# EAGLE board Precision Arduino 7400 (EAGLE 6.2), part 1 of 2
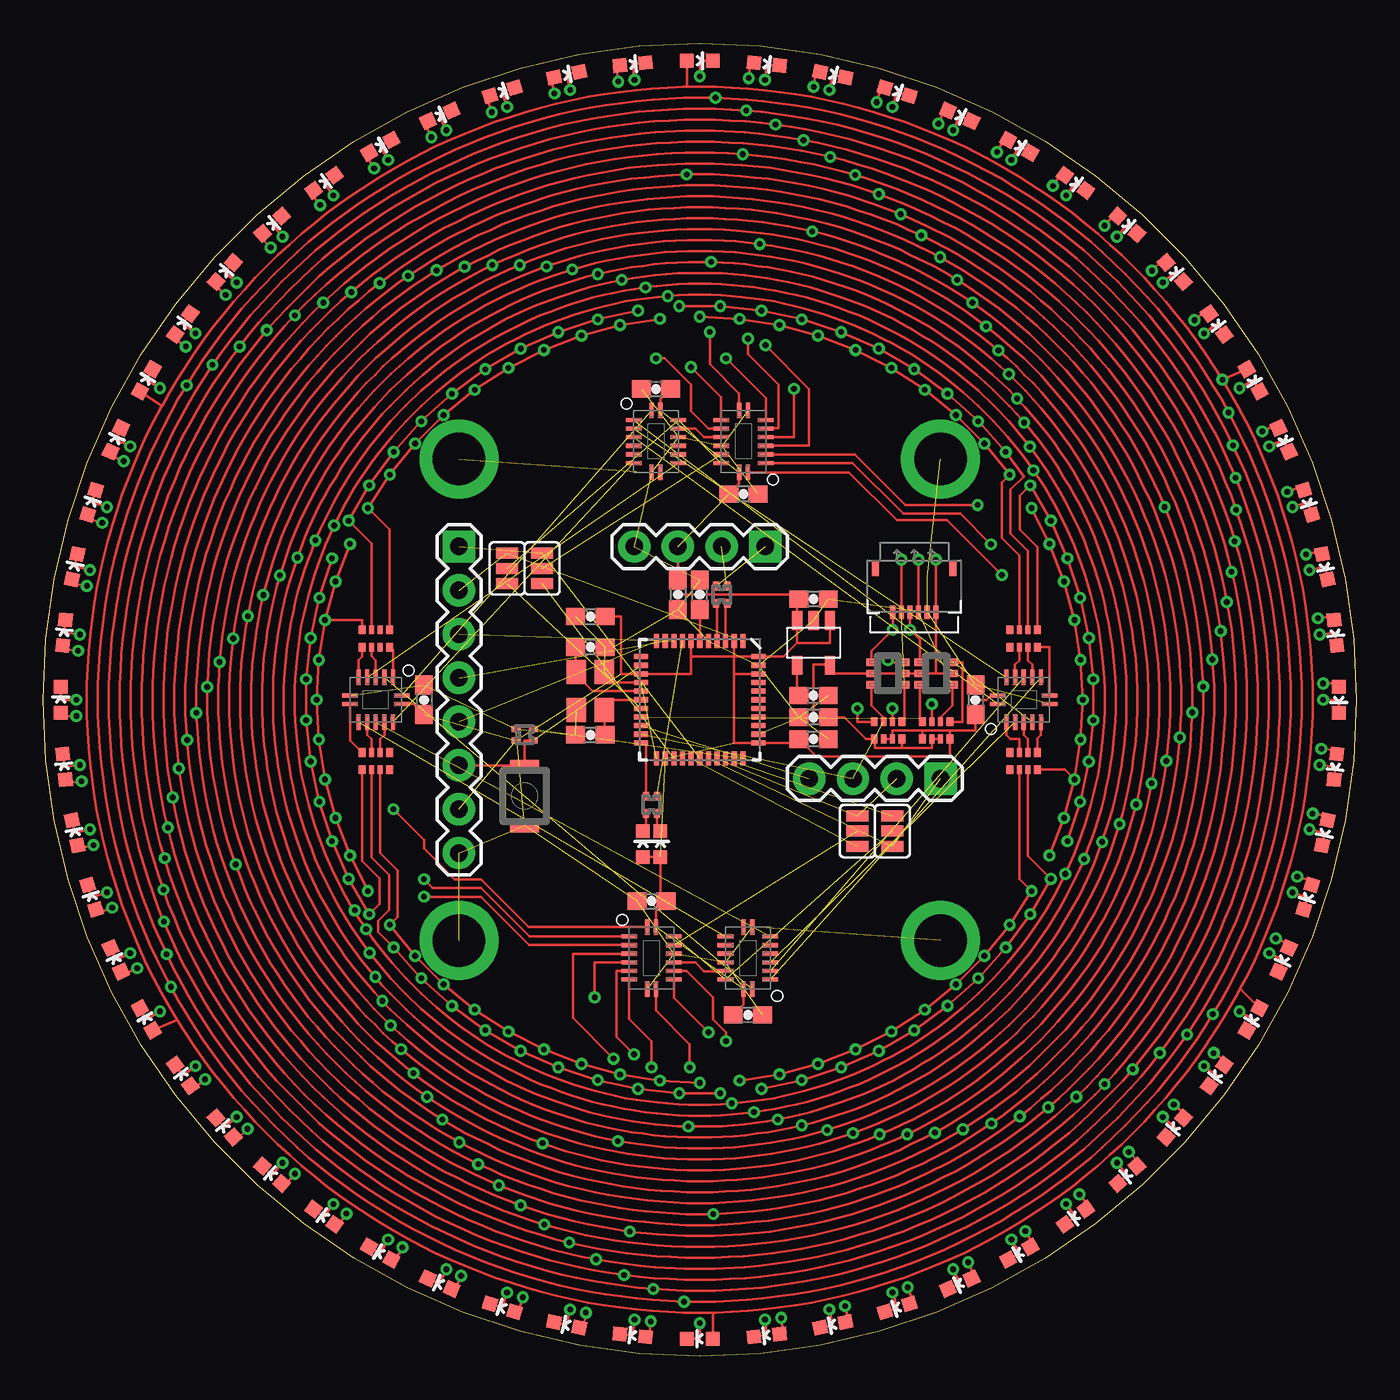
[diagram p1: board, top side]
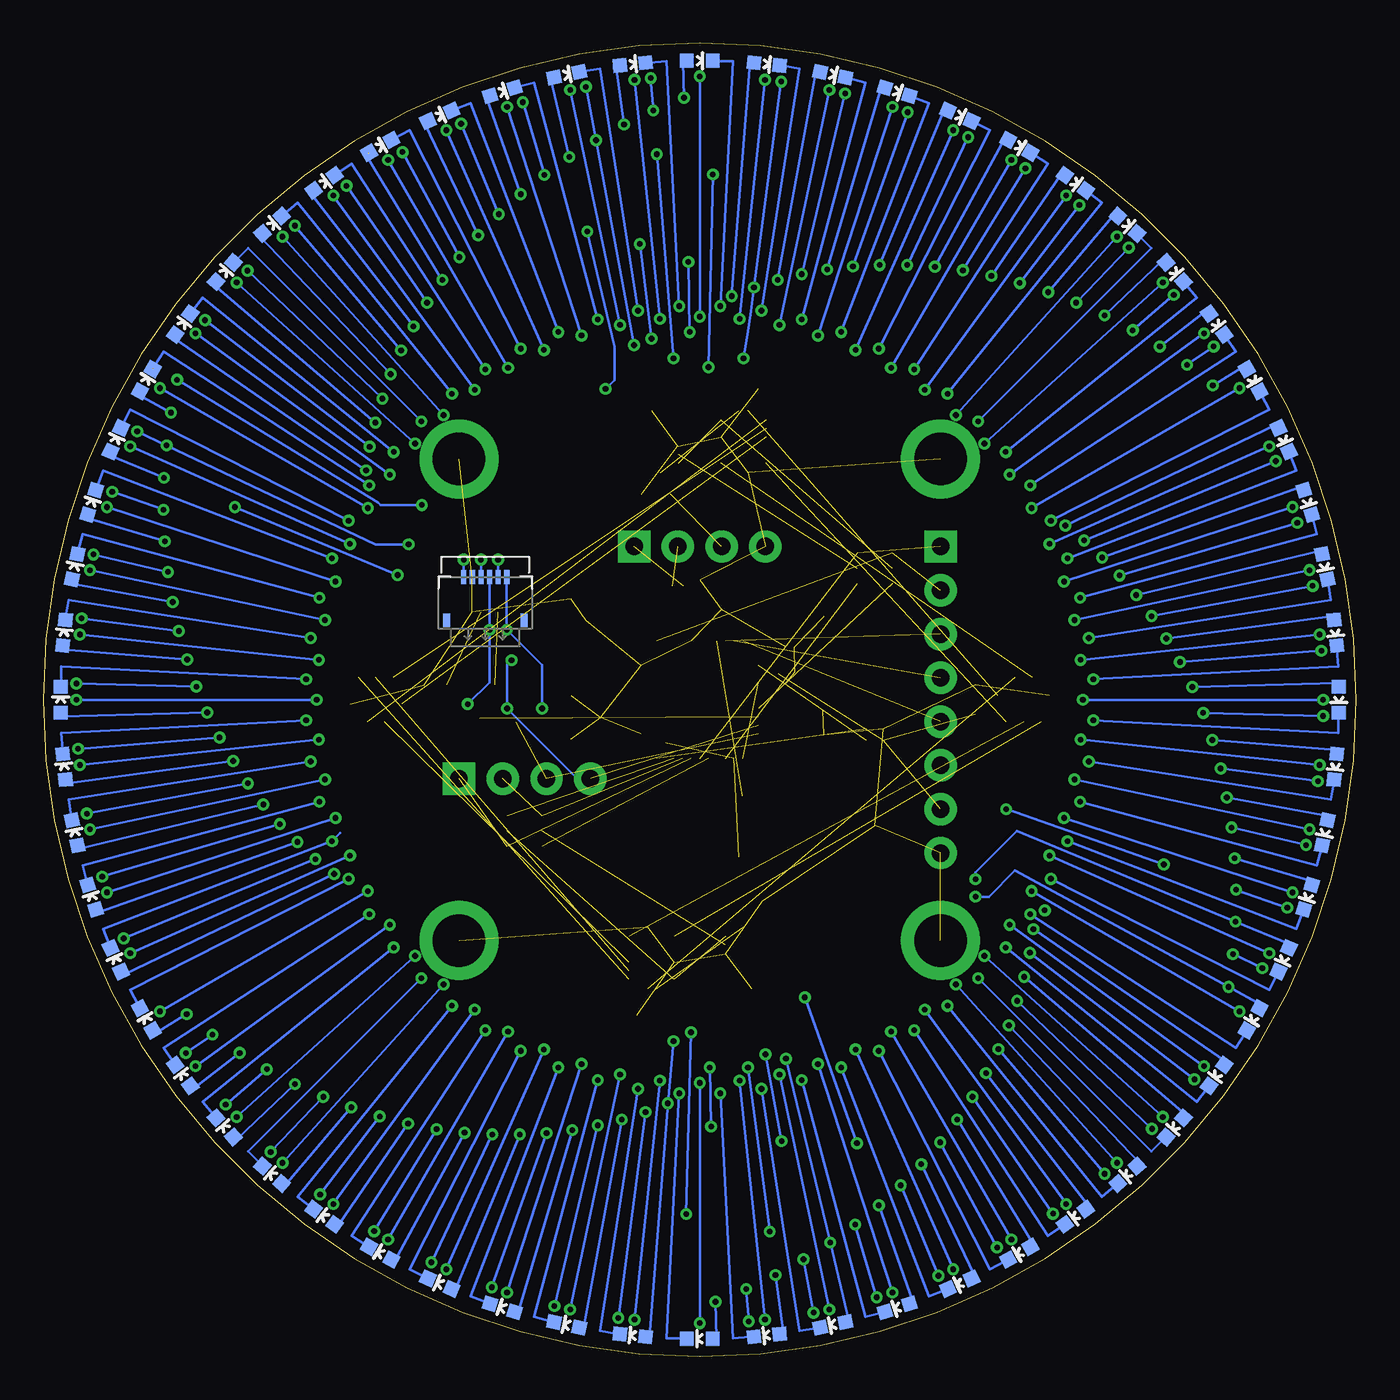
[diagram p2: board, bottom side, seen from below]

Size 76.2 x 76.2 mm. Coordinates in mm from the lower left corner, seen from the top.
Outline: 0,38.1 arc-90 38.1,76.2 arc-90 76.2,38.1 arc-90 38.1,0 arc-90 0,38.1
Copper layers (1*16): Top 0.0356mm / dielectric 1.5011mm / Bottom 0.0356mm
Design rules: minimum track width 6mil, minimum drill 13mil, track to track 6mil, track to pad 6mil, pad to pad 6mil, via to via 6mil, smd to smd 6mil, copper to edge 15mil, drill to drill 6mil, minimum pad ring 7mil, minimum via ring 7mil, stop-mask expansion 4mil, vias tented up to drill 0mil, thermal gap 10mil
Net classes: 0 default: width 0.152 mm, drill 0.33 mm, clearance 0.152 mm; 1 power: width 0.152 mm, drill 0.33 mm, clearance 0.152 mm

## Footprints (pad centres in the part's own frame; a part is rotated, then mirrored left to right if it is on the bottom)
0603-CAP = smd 1.1 x 1: 1 -0.85,0; 2 0.85,0
LED-0603 = smd 0.8 x 0.8: A 0,-0.75; C 0,0.75
STANDOFF = drill 3.048 pad 4.572: P$1 0,0
1X04 = drill 1.016 pad 1.88 square: 1 0,0 | drill 1.016 pad 1.88: 2 2.54,0; 3 5.08,0; 4 7.62,0
1X08 = drill 1.016 pad 1.88 square: 1 0,0 | drill 1.016 pad 1.88: 2 2.54,0; 3 5.08,0; 4 7.62,0; 5 10.16,0; 6 12.7,0; 7 15.24,0; 8 17.78,0
SOT-363 = smd 0.42 x 0.6: 1 -0.65,-0.95; 2 0,-0.95; 3 0.65,-0.95; 4 0.65,0.95; 5 0,0.95; 6 -0.65,0.95
CRA02 = smd 0.35 x 0.5: 1 -0.325,-0.5; 2 0.325,-0.5; 3 0.325,0.5; 4 -0.325,0.5
CRA04 = smd 0.4 x 0.5: 1 -0.8,-0.5; 4 0.8,-0.5; 5 0.8,0.5; 8 -0.8,0.5 | smd 0.3 x 0.5: 2 -0.25,-0.5; 3 0.25,-0.5; 6 0.25,0.5; 7 -0.25,0.5
SJ_3 = smd 0.635 x 1.27: 1 -0.889,0; 3 0.889,0; COM 0,0
B3U-1000P = smd 0.8 x 1.7: P$1 -1.7,0; P$2 1.7,0
DHVQFN16 = smd 0.9 x 0.24: 1 -1.8,-0.25; 8 1.8,-0.25; 9 1.8,0.25; 16 -1.8,0.25 | smd 0.24 x 0.9: 2 -1.25,-1.3; 3 -0.75,-1.3; 4 -0.25,-1.3; 5 0.25,-1.3; 6 0.75,-1.3; 7 1.25,-1.3; 10 1.25,1.3; 11 0.75,1.3; 12 0.25,1.3; 13 -0.25,1.3; 14 -0.75,1.3; 15 -1.25,1.3
DHVQFN14 = smd 0.9 x 0.24: 1 -1.5,-0.25; 7 1.5,-0.25; 8 1.5,0.25; 14 -1.5,0.25 | smd 0.24 x 0.9: 2 -1,-1.3; 3 -0.5,-1.3; 4 0,-1.3; 5 0.5,-1.3; 6 1,-1.3; 9 1,1.3; 10 0.5,1.3; 11 0,1.3; 12 -0.5,1.3; 13 -1,1.3
GP-2106 = smd 0.3 x 0.8: 1PPS -0.25,0; GND -0.75,0; ONOFF 0.25,0; RX 0.75,0; TX 1.25,0; VCC -1.25,0 | smd 0.4 x 0.8: P$7 -2.25,-2.5; P$8 2.25,-2.5
SOT-23-5 = smd 0.6 x 1.1: 1 -0.95,-1.3; 2 0,-1.3; 3 0.95,-1.3; 4 0.95,1.3; 5 -0.95,1.3
SPARKFUN-DIGITALIC_QFN-44-NOPAD = smd 0.8 x 0.3: 1 -3.4,2.5; 2 -3.4,2; 3 -3.4,1.5; 4 -3.4,1; 5 -3.4,0.5; 6 -3.4,0; 7 -3.4,-0.5; 8 -3.4,-1; 9 -3.4,-1.5; 10 -3.4,-2; 11 -3.4,-2.5; 23 3.4,-2.5; 24 3.4,-2; 25 3.4,-1.5; 26 3.4,-1; 27 3.4,-0.5; 28 3.4,0; 29 3.4,0.5; 30 3.4,1; 31 3.4,1.5; 32 3.4,2; 33 3.4,2.5 | smd 0.3 x 0.8: 12 -2.5,-3.4; 13 -2,-3.4; 14 -1.5,-3.4; 15 -1,-3.4; 16 -0.5,-3.4; 17 0,-3.4; 18 0.5,-3.4; 19 1,-3.4; 20 1.5,-3.4; 21 2,-3.4; 22 2.5,-3.4; 34 2.5,3.4; 35 2,3.4; 36 1.5,3.4; 37 1,3.4; 38 0.5,3.4; 39 0,3.4; 40 -0.5,3.4; 41 -1,3.4; 42 -1.5,3.4; 43 -2,3.4; 44 -2.5,3.4
CRYSTAL_SMD = smd 1.4 x 1.15: 1 -1.092,-0.813; 2 1.092,-0.813; 3 1.092,0.813; 4 -1.092,0.813

## Placement (x,y rotation side)
C001  100nF  [0603-CAP]  40.64,50.04 180 top
C002  100nF  [0603-CAP]  54.1,38.1 270 top
C004  4.7uF  [0603-CAP]  36.83,44.2 270 top
C010  100nF  [0603-CAP]  35.56,56.13 0 top
C035  100nF  [0603-CAP]  22.1,38.1 270 top
C101  100nF  [0603-CAP]  35.31,26.42 0 top
C110  100nF  [0603-CAP]  40.89,19.81 180 top
C201  4.7uF  [0603-CAP]  44.7,37.08 180 top
C203  100nF  [0603-CAP]  44.7,38.35 0 top
C204  1uF  [0603-CAP]  44.7,43.94 0 top
C406  1uF  [0603-CAP]  38.1,44.2 90 top
C414  100nF  [0603-CAP]  31.75,42.93 0 top
C416  18pF  [0603-CAP]  31.75,41.15 180 top
C417  18pF  [0603-CAP]  31.75,36.07 0 top
C434  100nF  [0603-CAP]  44.7,35.81 180 top
D000  RED  [LED-0603]  38.1,75.18 270 top
D001  RED  [LED-0603]  41.99,74.98 264 top
D002  RED  [LED-0603]  45.82,74.37 258 top
D003  RED  [LED-0603]  49.56,73.38 252 top
D004  RED  [LED-0603]  53.19,71.98 246 top
D005  RED  [LED-0603]  56.64,70.21 240 top
D006  RED  [LED-0603]  59.89,68.1 234 top
D007  RED  [LED-0603]  62.92,65.66 228 top
D008  RED  [LED-0603]  65.66,62.92 222 top
D009  RED  [LED-0603]  68.1,59.89 216 top
D010  RED  [LED-0603]  70.21,56.64 210 top
D011  RED  [LED-0603]  71.98,53.19 204 top
D012  RED  [LED-0603]  73.38,49.56 198 top
D013  RED  [LED-0603]  74.37,45.82 192 top
D014  RED  [LED-0603]  74.98,41.99 186 top
D015  RED  [LED-0603]  75.18,38.1 180 top
D016  RED  [LED-0603]  74.98,34.21 174 top
D017  RED  [LED-0603]  74.37,30.38 168 top
D018  RED  [LED-0603]  73.38,26.64 162 top
D019  RED  [LED-0603]  71.98,23.01 156 top
D020  RED  [LED-0603]  70.21,19.56 150 top
D021  RED  [LED-0603]  68.1,16.31 144 top
D022  RED  [LED-0603]  65.66,13.28 138 top
D023  RED  [LED-0603]  62.92,10.54 132 top
D024  RED  [LED-0603]  59.89,8.1 126 top
D025  RED  [LED-0603]  56.64,5.99 120 top
D026  RED  [LED-0603]  53.19,4.22 114 top
D027  RED  [LED-0603]  49.56,2.82 108 top
D028  RED  [LED-0603]  45.82,1.83 102 top
D029  RED  [LED-0603]  41.99,1.22 96 top
D030  RED  [LED-0603]  38.1,1.02 90 top
D031  RED  [LED-0603]  34.21,1.22 84 top
D032  RED  [LED-0603]  30.38,1.83 78 top
D033  RED  [LED-0603]  26.64,2.82 72 top
D034  RED  [LED-0603]  23.01,4.22 66 top
D035  RED  [LED-0603]  19.56,5.99 60 top
D036  RED  [LED-0603]  16.31,8.1 54 top
D037  RED  [LED-0603]  13.28,10.54 48 top
D038  RED  [LED-0603]  10.54,13.28 42 top
D039  RED  [LED-0603]  8.1,16.31 36 top
D040  RED  [LED-0603]  5.99,19.56 30 top
D041  RED  [LED-0603]  4.22,23.01 24 top
D042  RED  [LED-0603]  2.82,26.64 18 top
D043  RED  [LED-0603]  1.83,30.38 12 top
D044  RED  [LED-0603]  1.22,34.21 6 top
D045  RED  [LED-0603]  1.02,38.1 0 top
D046  RED  [LED-0603]  1.22,41.99 354 top
D047  RED  [LED-0603]  1.83,45.82 348 top
D048  RED  [LED-0603]  2.82,49.56 342 top
D049  RED  [LED-0603]  4.22,53.19 336 top
D050  RED  [LED-0603]  5.99,56.64 330 top
D051  RED  [LED-0603]  8.1,59.89 324 top
D052  RED  [LED-0603]  10.54,62.92 318 top
D053  RED  [LED-0603]  13.28,65.66 312 top
D054  RED  [LED-0603]  16.31,68.1 306 top
D055  RED  [LED-0603]  19.56,70.21 300 top
D056  RED  [LED-0603]  23.01,71.98 294 top
D057  RED  [LED-0603]  26.64,73.38 288 top
D058  RED  [LED-0603]  30.38,74.37 282 top
D059  RED  [LED-0603]  34.21,74.98 276 top
D100  RED  [LED-0603]  38.1,75.18 270 bottom
D101  RED  [LED-0603]  41.99,74.98 276 bottom
D102  RED  [LED-0603]  45.82,74.37 282 bottom
D103  RED  [LED-0603]  49.56,73.38 288 bottom
D104  RED  [LED-0603]  53.19,71.98 294 bottom
D105  RED  [LED-0603]  56.64,70.21 300 bottom
D106  RED  [LED-0603]  59.89,68.1 306 bottom
D107  RED  [LED-0603]  62.92,65.66 312 bottom
D108  RED  [LED-0603]  65.66,62.92 318 bottom
D109  RED  [LED-0603]  68.1,59.89 324 bottom
D110  RED  [LED-0603]  70.21,56.64 330 bottom
D111  RED  [LED-0603]  71.98,53.19 336 bottom
D112  RED  [LED-0603]  73.38,49.56 342 bottom
D113  RED  [LED-0603]  74.37,45.82 348 bottom
D114  RED  [LED-0603]  74.98,41.99 354 bottom
D115  RED  [LED-0603]  75.18,38.1 0 bottom
D116  RED  [LED-0603]  74.98,34.21 6 bottom
D117  RED  [LED-0603]  74.37,30.38 12 bottom
D118  RED  [LED-0603]  73.38,26.64 18 bottom
D119  RED  [LED-0603]  71.98,23.01 24 bottom
D120  RED  [LED-0603]  70.21,19.56 30 bottom
D121  RED  [LED-0603]  68.1,16.31 36 bottom
D122  RED  [LED-0603]  65.66,13.28 42 bottom
D123  RED  [LED-0603]  62.92,10.54 48 bottom
D124  RED  [LED-0603]  59.89,8.1 54 bottom
D125  RED  [LED-0603]  56.64,5.99 60 bottom
D126  RED  [LED-0603]  53.19,4.22 66 bottom
D127  RED  [LED-0603]  49.56,2.82 72 bottom
D128  RED  [LED-0603]  45.82,1.83 78 bottom
D129  RED  [LED-0603]  41.99,1.22 84 bottom
D130  RED  [LED-0603]  38.1,1.02 90 bottom
D131  RED  [LED-0603]  34.21,1.22 96 bottom
D132  RED  [LED-0603]  30.38,1.83 102 bottom
D133  RED  [LED-0603]  26.64,2.82 108 bottom
D134  RED  [LED-0603]  23.01,4.22 114 bottom
D135  RED  [LED-0603]  19.56,5.99 120 bottom
D136  RED  [LED-0603]  16.31,8.1 126 bottom
D137  RED  [LED-0603]  13.28,10.54 132 bottom
D138  RED  [LED-0603]  10.54,13.28 138 bottom
D139  RED  [LED-0603]  8.1,16.31 144 bottom
D140  RED  [LED-0603]  5.99,19.56 150 bottom
D141  RED  [LED-0603]  4.22,23.01 156 bottom
D142  RED  [LED-0603]  2.82,26.64 162 bottom
D143  RED  [LED-0603]  1.83,30.38 168 bottom
D144  RED  [LED-0603]  1.22,34.21 174 bottom
D145  RED  [LED-0603]  1.02,38.1 180 bottom
D146  RED  [LED-0603]  1.22,41.99 186 bottom
D147  RED  [LED-0603]  1.83,45.82 192 bottom
D148  RED  [LED-0603]  2.82,49.56 198 bottom
D149  RED  [LED-0603]  4.22,53.19 204 bottom
D150  RED  [LED-0603]  5.99,56.64 210 bottom
D151  RED  [LED-0603]  8.1,59.89 216 bottom
D152  RED  [LED-0603]  10.54,62.92 222 bottom
D153  RED  [LED-0603]  13.28,65.66 228 bottom
D154  RED  [LED-0603]  16.31,68.1 234 bottom
D155  RED  [LED-0603]  19.56,70.21 240 bottom
D156  RED  [LED-0603]  23.01,71.98 246 bottom
D157  RED  [LED-0603]  26.64,73.38 252 bottom
D158  RED  [LED-0603]  30.38,74.37 258 bottom
D159  RED  [LED-0603]  34.21,74.98 264 bottom
D408  RED  [LED-0603]  35.81,29.72 0 top
D422  BLUE  [LED-0603]  34.8,29.72 0 top
JP1  STANDOFF  [STANDOFF]  52.07,52.07 0 top
JP2  STANDOFF  [STANDOFF]  52.07,24.13 0 top
JP3  STANDOFF  [STANDOFF]  24.13,52.07 0 top
JP4  STANDOFF  [STANDOFF]  24.13,24.13 0 top
JP5  [1X04]  52.07,33.53 180 top
JPRG  [1X08]  24.13,46.99 270 top
JUSB1  [1X04]  41.91,46.99 180 top
Q301  BSS138DW  [SOT-363]  49.02,39.62 270 top
Q302  BSS138DW  [SOT-363]  51.82,39.62 90 top
R5  22  [CRA02]  39.37,44.2 180 top
R020  91  [CRA04]  56.9,34.54 180 top
R021  91  [CRA04]  56.9,41.66 0 top
R301  10k  [CRA04]  51.82,36.32 180 top
R302  10k  [CRA04]  49.02,36.32 180 top
R350  91  [CRA04]  19.3,34.54 180 top
R351  91  [CRA04]  19.3,41.66 0 top
R413  10k  [CRA02]  27.94,36.07 270 top
R501  680  [CRA02]  35.31,32 180 top
S0C  SOLDERJUMPER_3WAY  [SJ_3]  28.96,45.72 270 top
S0R  SOLDERJUMPER_3WAY  [SJ_3]  26.92,45.72 270 top
S1C  SOLDERJUMPER_3WAY  [SJ_3]  47.24,30.48 90 top
S1R  SOLDERJUMPER_3WAY  [SJ_3]  49.28,30.48 90 top
S429  B3U-1000P  [B3U-1000P]  27.94,32.51 90 top
U001  74HC4017  [DHVQFN16]  40.64,53.09 90 top
U002  74LVC14A  [DHVQFN14]  56.9,38.1 0 top
U003  GP-2106  [GP-2106]  50.55,43.18 180 top
U004  GP-2106  [GP-2106]  50.55,45.21 0 bottom
U010  74HC4017  [DHVQFN16]  35.56,53.09 270 top
U035  74LVC14A  [DHVQFN14]  19.3,38.1 180 top
U101  74HC4017  [DHVQFN16]  35.31,23.11 270 top
U110  74HC4017  [DHVQFN16]  40.89,23.11 90 top
U201  1.8V  [SOT-23-5]  44.7,41.4 180 top
U401  ATMEGA32U4QFN2  [SPARKFUN-DIGITALIC_QFN-44-NOPAD]  38.1,38.1 270 top
Y401  16MHz  [CRYSTAL_SMD]  31.75,38.61 90 top

## Tracks (layer width: path | path; a pad name or v marks a point on that pad's centre or on a via)
1.8V  (via drill 0.33)
  Top 0.152: 51.8,39.62 Q302.5 Q301.5 Q301.2 45.65,39.62 U201.5 45.65,40.13 44.7,40.13 44.7,37.08 C201.1 46.48,37.08 47.74,35.82 R302.5 48.26,35.78 48.26,35.31 49.82,35.31 | 51.8,39.62 Q302.2 | 51.8,39.62 U003.VCC 51.8,45.72 v51.8,46.23 | 49.78,35.82 R302.8 49.82,35.31 | R301.7 R301.6 51.57,35.31 49.82,35.31
  Bottom 0.152: U004.VCC v51.8,46.23
C0  (1 unrouted)
C1  (1 unrouted)
C2  (2 unrouted)
C3  (2 unrouted)
CARRY0
  Top 0.152: U010.14 37.86,53.84 38.36,53.34 U001.12
CARRY1
  Top 0.152: U101.12 37.84,22.86 38.35,22.35 U110.14
CLK0  (1 unrouted)
CLK1  (1 unrouted)
D+  (1 unrouted)
D-  (1 unrouted)
GND  (41 unrouted)
  Top 0.152: 33.1,39.09 U401.15 | C416.1 33.1,41.15 | 39.32,52.83 U001.13 39.4,52.83 | 36.88,53.34 U010.13
HWB  (1 unrouted)
MISO  (1 unrouted)
MOSI  (1 unrouted)
N$17
  Top 0.152: U201.4 43.75,38.35 C203.1
ONOFF
  Top 0.152: Q302.3 53.34,40.27 53.34,36.82 R301.1
ONOFF_LO  (via drill 0.33)
  Top 0.152: U003.ONOFF v50.3,42.16 50.87,41.59 Q302.4 | R301.3 v51.57,37.84 arc90 v51.56,37.85
  Bottom 0.152: U004.ONOFF v50.3,42.16 50.3,39.11 v51.56,37.85
P00X  (1 unrouted)
P0X0  (via drill 0.33)  (1 unrouted)
  Top 0.152: 37.34,73.66 37.16,73.66 36.25,73.61 35.31,73.56 34.39,73.46 33.45,73.36 32.54,73.23 31.62,73.08 29.79,72.67 28.91,72.44 27.99,72.19 27.1,71.91 26.24,71.63 25.35,71.3 24.49,70.94 23.65,70.59 22.78,70.21 21.95,69.77 21.13,69.34 20.32,68.89 19.53,68.43 17.96,67.41 17.2,66.88 16.46,66.32 15.72,65.73 15.01,65.15 14.3,64.52 13.61,63.91 12.29,62.59 11.68,61.9 11.05,61.19 10.46,60.48 9.88,59.74 9.32,59 8.79,58.24 7.77,56.67 7.32,55.88 6.9,55.14 | 37.34,73.66 39.04,73.66 39.95,73.61 40.89,73.56 41.81,73.46 42.75,73.36 43.66,73.23 44.58,73.08 46.41,72.67 47.3,72.44 48.21,72.19 49.1,71.91 49.96,71.63 50.85,71.3 51.71,70.94 52.55,70.59 53.42,70.21 54.25,69.77 55.07,69.34 55.88,68.89 56.67,68.43 58.24,67.41 59,66.88 59.74,66.32 60.48,65.73 61.19,65.15 61.9,64.52 62.59,63.91 63.91,62.59 64.52,61.9 65.15,61.19 65.73,60.48 66.32,59.74 66.88,59 67.41,58.24 68.06,57.24 68.26,56.93 v68.43,56.67 | v68.43,56.67 68.89,55.88 69.34,55.07 69.77,54.25 70.21,53.42 70.59,52.55 70.94,51.71 71.3,50.85 71.63,49.96 71.91,49.1 72.19,48.21 72.44,47.3 72.67,46.41 73.08,44.58 73.23,43.66 73.36,42.75 73.46,41.81 73.56,40.89 73.61,39.95 73.66,39.04 73.66,37.16 73.61,36.25 73.56,35.31 73.46,34.39 73.36,33.45 73.23,32.54 73.08,31.62 72.67,29.79 72.44,28.91 72.19,27.99 71.91,27.1 71.63,26.24 71.3,25.35 70.94,24.49 70.59,23.65 70.21,22.78 69.77,21.95 69.44,21.32 | 69.44,21.32 69.34,21.13 68.89,20.32 68.43,19.53 67.41,17.96 66.88,17.2 66.32,16.46 65.73,15.72 65.15,15.01 64.52,14.3 63.91,13.61 62.59,12.29 61.9,11.68 61.19,11.05 60.48,10.46 59.74,9.88 59,9.32 58.24,8.79 56.67,7.77 55.88,7.32 55.07,6.86 54.25,6.43 53.42,5.99 52.55,5.61 51.71,5.26 50.85,4.9 49.96,4.57 49.1,4.29 48.21,4.01 47.3,3.76 46.41,3.53 44.58,3.12 43.66,2.97 42.75,2.85 41.81,2.74 40.89,2.64 39.95,2.59 39.04,2.54 38.86,2.54
  Top 0.152: 38.86,2.54 37.16,2.54 36.25,2.59 35.31,2.64 34.39,2.74 33.45,2.85 32.54,2.97 31.62,3.12 29.79,3.53 28.91,3.76 27.99,4.01 27.1,4.29 26.24,4.57 25.35,4.9 24.49,5.26 23.65,5.61 22.78,5.99 21.95,6.43 21.13,6.86 20.32,7.32 19.53,7.77 17.96,8.79 17.2,9.32 16.46,9.88 15.72,10.46 15.01,11.05 14.3,11.68 13.61,12.29 12.29,13.61 11.68,14.3 11.05,15.01 10.46,15.72 9.88,16.46 9.32,17.2 8.79,17.96 8.14,18.96 7.77,19.53 | 7.77,19.53 7.32,20.32 6.86,21.13 6.43,21.95 5.99,22.78 5.61,23.65 5.26,24.49 4.9,25.35 4.57,26.24 4.29,27.1 4.01,27.99 3.76,28.91 3.53,29.79 3.12,31.62 2.97,32.54 2.85,33.45 2.74,34.39 2.64,35.31 2.59,36.25 2.54,37.16 2.54,39.04 2.59,39.95 2.64,40.89 2.74,41.81 2.85,42.75 2.97,43.66 3.12,44.58 3.53,46.41 3.76,47.3 4.01,48.21 4.29,49.1 4.57,49.96 4.9,50.85 5.26,51.71 5.61,52.55 5.99,53.42 6.43,54.25 6.86,55.07 6.9,55.14 | D000.A 37.35,73.67 37.34,73.66 | 38.86,2.54 38.86,1.02 D030.A | 6.38,18.92 D040.A 7.77,19.53 | 70.56,20.22 69.49,21.29 69.44,21.32 | 70.56,20.22 D020.A | D020.A | D050.A 5.64,55.98 6.9,55.14 | 69.83,57.28 D010.A v68.43,56.67 | U001.3 47.1,52.34 50.04,49.4 v54.23,49.4 | D020.A 70.56,20.22
  Bottom 0.152: v68.43,56.67 56.76,49.55 | 56.76,49.54 56.76,49.55 | v54.23,49.4 56.62,49.4 56.76,49.55
P0X1  (via drill 0.33)
  Top 0.152: v40.95,74.17 41.02,75.06 41.22,75.06 D001.A | 71.58,54.08 71.55,54.06 | 71.55,54.06 v70.74,53.67 | v67.92,17.6 68.66,17.09 68.66,17.02 68.56,16.92 D021.A | v35.26,2.03 35.18,1.14 34.98,1.14 D031.A | 4.62,22.12 4.65,22.14 | 4.65,22.14 v5.46,22.53 | v8.28,58.6 7.54,59.11 7.54,59.18 7.64,59.28 D051.A | D041.A 4.55,22.33 4.62,22.25 4.62,22.2 4.65,22.14 | D011.A 71.65,53.87 71.58,53.95 71.58,54 71.55,54.06 | U001.2 46.97,51.84 49.91,48.9 53.21,48.9 v54.99,47.12 | 36.3,72.34 37.21,72.39 38.99,72.39 39.9,72.34 v40.79,72.29 41.68,72.21 43.46,71.96 44.35,71.81 45.24,71.63 46.1,71.45 46.97,71.22 48.69,70.71 49.55,70.43 51.23,69.77 52.05,69.42 53.67,68.66 55.24,67.79 56.01,67.33 57.53,66.37 58.27,65.84 58.98,65.3 59.69,64.75 60.38,64.19 62.36,62.36 64.19,60.38 64.75,59.69 65.3,58.98 65.84,58.27 66.37,57.53 67.33,56.01 67.79,55.24 68.66,53.67 v69.04,52.86 69.42,52.05 69.77,51.23 70.43,49.55 70.71,48.69 71.22,46.97 71.45,46.1 71.63,45.24 71.81,44.35 71.96,43.46 72.21,41.68 72.29,40.79 72.34,39.9 72.39,38.99 72.39,37.21 72.34,36.3 72.29,35.41 72.21,34.52 71.96,32.74 71.81,31.85 71.63,30.96 71.45,30.1 71.22,29.23 70.71,27.51 70.43,26.64 69.77,24.97 69.42,24.16 68.66,22.53 67.79,20.95 67.33,20.19 v66.37,18.67 65.84,17.93 65.3,17.22 64.75,16.51 64.19,15.82 62.36,13.84 60.38,12.01 59.69,11.46 58.98,10.9 58.27,10.36 57.53,9.83 56.01,8.87 55.24,8.41 53.67,7.54 52.05,6.78 51.23,6.43 49.55,5.77 48.69,5.49 46.97,4.98 46.1,4.75 45.24,4.57 44.35,4.39 43.46,4.24 41.68,3.99 40.79,3.91 39.9,3.86 38.99,3.81 37.21,3.81 36.3,3.86 v35.41,3.91 34.52,3.99 32.74,4.24 31.85,4.39 30.96,4.57 30.1,4.75 29.23,4.98 27.51,5.49 26.64,5.77 24.97,6.43 24.16,6.78 22.53,7.54 20.95,8.41 20.19,8.87 18.67,9.83 17.93,10.36 17.22,10.9 16.51,11.46 15.82,12.01 13.84,13.84 12.01,15.82 11.46,16.51 10.9,17.22 10.36,17.93 9.83,18.67 8.87,20.19 8.41,20.95 7.54,22.53 v7.16,23.34 6.78,24.16 6.43,24.97 5.77,26.64 5.49,27.51 4.98,29.23 4.75,30.1 4.57,30.96 4.39,31.85 4.24,32.74 3.99,34.52 3.91,35.41 3.86,36.3 3.81,37.21 3.81,38.99 3.86,39.9 3.91,40.79 3.99,41.68 4.24,43.46 4.39,44.35 4.57,45.24 4.75,46.1 4.98,46.97 5.49,48.69 5.77,49.55 6.43,51.23 6.78,52.05 7.54,53.67 8.41,55.24 8.87,56.01 v9.83,57.53 10.36,58.27 10.9,58.98 11.46,59.69 12.01,60.38 13.84,62.36 15.82,64.19 16.51,64.75 17.22,65.3 17.93,65.84 18.67,66.37 20.19,67.33 20.95,67.79 22.53,68.66 24.16,69.42 24.97,69.77 26.64,70.43 27.51,70.71 29.23,71.22 30.1,71.45 30.96,71.63 31.85,71.81 32.74,71.96 34.52,72.21 35.41,72.29 36.3,72.34
  Bottom 0.152: v40.79,72.29 v40.95,74.17 | v70.74,53.67 v69.04,52.86 56.9,47.09 55.02,47.09 v54.99,47.12 | v66.37,18.67 v67.92,17.6 | v35.41,3.91 v35.26,2.03 | v7.16,23.34 v5.46,22.53 | v9.83,57.53 v8.28,58.6
P0X2  (via drill 0.33)
  Top 0.152: 44.86,74.57 44.85,74.53 | 44.85,74.53 v44.7,73.66 | 73.05,50.47 73.03,50.46 | 73.03,50.46 v72.19,50.16 | v65.61,14.61 66.29,14.02 66.27,13.95 D022.A | 31.34,1.63 31.35,1.67 | 31.35,1.67 v31.5,2.54 | 3.15,25.73 3.17,25.74 | 3.17,25.74 v4.01,26.04 | v10.59,61.59 9.91,62.18 9.93,62.26 D052.A | D042.A 3.07,25.91 3.15,25.83 3.15,25.81 3.17,25.74 | 73.03,50.46 73.05,50.39 73.13,50.32 73.13,50.29 D012.A | D032.A 31.29,1.68 31.35,1.67 | D002.A 44.91,74.52 44.85,74.53 | U001.4 44.45,52.84 44.45,56.13 v41.91,58.67 | 37.24,71.12 38.96,71.12 40.69,71.02 41.55,70.94 42.42,70.84 43.26,70.71 v44.12,70.56 44.96,70.41 46.63,70 48.31,69.49 49.94,68.94 50.72,68.61 51.54,68.28 52.32,67.89 53.09,67.51 54.61,66.7 56.08,65.79 57.51,64.82 58.88,63.75 59.54,63.22 60.2,62.64 60.83,62.05 62.05,60.83 62.64,60.2 63.22,59.54 63.75,58.88 64.82,57.51 65.79,56.08 66.7,54.61 67.51,53.09 67.89,52.32 68.28,51.54 68.61,50.72 68.94,49.94 v69.22,49.12 69.49,48.31 70,46.63 70.41,44.96 70.56,44.12 70.71,43.26 70.84,42.42 70.94,41.55 71.02,40.69 71.12,38.96 71.12,37.24 71.02,35.51 70.94,34.65 70.84,33.78 70.71,32.94 70.56,32.08 70.41,31.24 70,29.57 69.49,27.89 68.94,26.26 68.61,25.48 68.28,24.66 67.89,23.88 67.51,23.11 66.7,21.59 65.79,20.12 64.82,18.69 63.75,17.32 v63.22,16.66 62.64,16 62.05,15.37 60.83,14.15 60.2,13.56 59.54,12.98 58.88,12.45 57.51,11.38 56.08,10.41 54.61,9.5 53.09,8.69 52.32,8.31 51.54,7.92 50.72,7.59 49.94,7.26 48.31,6.71 46.63,6.2 44.96,5.79 44.12,5.64 43.26,5.49 42.42,5.36 41.55,5.26 40.69,5.18 38.96,5.08 37.24,5.08 35.51,5.18 34.65,5.26 33.78,5.36 32.94,5.49 v32.08,5.64 31.24,5.79 29.57,6.2 27.89,6.71 26.26,7.26 25.48,7.59 24.66,7.92 23.88,8.31 23.11,8.69 21.59,9.5 20.12,10.41 18.69,11.38 17.32,12.45 16.66,12.98 16,13.56 15.37,14.15 14.15,15.37 13.56,16 12.98,16.66 12.45,17.32 11.38,18.69 10.41,20.12 9.5,21.59 8.69,23.11 8.31,23.88 7.92,24.66 7.59,25.48 7.26,26.26 v6.99,27.08 6.71,27.89 6.2,29.57 5.79,31.24 5.64,32.08 5.49,32.94 5.36,33.78 5.26,34.65 5.18,35.51 5.08,37.24 5.08,38.96 5.18,40.69 5.26,41.55 5.36,42.42 5.49,43.26 5.64,44.12 5.79,44.96 6.2,46.63 6.71,48.31 7.26,49.94 7.59,50.72 7.92,51.54 8.31,52.32 8.69,53.09 9.5,54.61 10.41,56.08 11.38,57.51 12.45,58.88 v12.98,59.54 13.56,60.2 14.15,60.83 15.37,62.05 16,62.64 16.66,63.22 17.32,63.75 18.69,64.82 20.12,65.79 21.59,66.7 23.11,67.51 23.88,67.89 24.66,68.28 25.48,68.61 26.26,68.94 27.89,69.49 29.57,70 31.24,70.41 32.08,70.56 32.94,70.71 33.78,70.84 34.65,70.94 35.51,71.02 37.24,71.12
  Bottom 0.152: v44.7,73.66 v44.12,70.56 v41.91,58.67 | v69.22,49.12 v72.19,50.16 | v63.22,16.66 v65.61,14.61 | v32.08,5.64 v31.5,2.54 | v6.99,27.08 v4.01,26.04 | v12.98,59.54 v10.59,61.59
P0X3  (via drill 0.33)
  Top 0.152: v48.36,72.77 48.64,73.66 48.82,73.66 48.82,73.64 D003.A | 74.17,46.76 74.15,46.76 | 74.15,46.76 v73.28,46.53 | v62.99,11.86 63.63,11.2 D023.A | 27.56,2.54 27.57,2.57 | 27.57,2.57 v27.84,3.43 | 2.03,29.44 2.05,29.44 | 2.05,29.44 v2.92,29.67 | v13.21,64.34 12.57,65 D053.A | D033.A 27.38,2.59 27.51,2.59 27.57,2.57 | D043.A 2.01,29.64 2.03,29.62 2.03,29.52 2.05,29.44 | D013.A 74.19,46.56 74.17,46.58 74.17,46.69 74.15,46.76 | v39.62,57.91 41.94,55.6 U001.7 | 36.45,69.8 37.26,69.85 38.94,69.85 39.75,69.8 v40.59,69.75 41.43,69.67 42.24,69.57 43.08,69.47 43.96,69.3 44.7,69.16 46.33,68.76 v47.12,68.56 47.9,68.3 49.48,67.74 50.24,67.44 51,67.11 51.77,66.75 52.5,66.4 53.24,66.02 53.98,65.61 54.69,65.18 55.4,64.72 56.08,64.26 56.77,63.78 57.43,63.3 58.09,62.76 58.73,62.26 59.94,61.14 60.55,60.55 61.14,59.94 62.26,58.73 62.76,58.09 63.3,57.43 63.78,56.77 64.26,56.08 64.72,55.4 65.18,54.69 65.61,53.98 66.02,53.24 66.4,52.5 66.75,51.77 67.11,51 67.44,50.24 67.74,49.48 68.3,47.9 68.56,47.12 68.76,46.33 v68.96,45.52 69.16,44.7 69.47,43.08 69.57,42.24 69.67,41.43 69.75,40.59 69.8,39.75 69.85,38.94 69.85,37.26 69.8,36.45 69.75,35.61 69.67,34.77 69.57,33.96 69.47,33.12 69.16,31.5 68.76,29.87 68.56,29.08 68.3,28.3 67.74,26.72 67.44,25.96 67.11,25.2 66.75,24.43 66.4,23.7 66.02,22.96 65.61,22.23 65.18,21.51 64.72,20.8 64.26,20.12 63.78,19.43 63.3,18.77 62.76,18.11 62.26,17.48 61.14,16.26 60.55,15.65 v59.94,15.06 58.73,13.95 58.09,13.44 57.43,12.9 56.77,12.42 56.08,11.94 55.4,11.48 54.69,11.02 53.98,10.59 53.24,10.19 52.5,9.8 51.77,9.45 51,9.09 50.24,8.76 49.48,8.46 47.9,7.9 47.12,7.64 46.33,7.44 44.7,7.04 43.08,6.73 42.24,6.63 41.43,6.53 40.59,6.45 39.75,6.4 38.94,6.35 37.26,6.35 36.45,6.4 35.61,6.45 34.77,6.53 33.96,6.63 33.12,6.73 31.5,7.04 29.87,7.44 v29.08,7.64 28.3,7.9 26.72,8.46 25.96,8.76 25.2,9.09 24.43,9.45 23.7,9.8 22.96,10.19 22.23,10.59 21.51,11.02 20.8,11.48 20.12,11.94 19.43,12.42 18.77,12.9 18.11,13.44 17.48,13.95 16.26,15.06 15.65,15.65 15.06,16.26 13.95,17.48 13.44,18.11 12.9,18.77 12.42,19.43 11.94,20.12 11.48,20.8 11.02,21.51 10.59,22.23 10.19,22.96 9.8,23.7 9.45,24.43 9.09,25.2 8.76,25.96 8.46,26.72 7.9,28.3 7.64,29.08 7.44,29.87 v7.24,30.68 7.04,31.5 6.73,33.12 6.63,33.96 6.53,34.77 6.45,35.61 6.4,36.45 6.35,37.26 6.35,38.94 6.4,39.75 6.45,40.59 6.53,41.43 6.63,42.24 6.73,43.08 7.04,44.7 7.44,46.33 7.64,47.12 7.9,47.9 8.46,49.48 8.76,50.24 9.09,51 9.45,51.77 9.8,52.5 10.19,53.24 10.59,53.98 11.02,54.69 11.48,55.4 11.94,56.08 12.42,56.77 12.9,57.43 13.44,58.09 13.95,58.73 15.06,59.94 15.65,60.55 v16.26,61.14 17.48,62.26 18.11,62.76 18.77,63.3 19.43,63.78 20.12,64.26 20.8,64.72 21.51,65.18 22.23,65.61 22.96,66.02 23.7,66.4 24.43,66.75 25.2,67.11 25.96,67.44 26.72,67.74 28.3,68.3 29.08,68.56 29.87,68.76 31.5,69.16 33.12,69.47 33.96,69.57 34.77,69.67 35.61,69.75 36.45,69.8
  Bottom 0.152: v47.12,68.56 v48.36,72.77 | v68.96,45.52 v73.28,46.53 | v59.94,15.06 v62.99,11.86 | v29.08,7.64 v27.84,3.43 | v7.24,30.68 v2.92,29.67 | v16.26,61.14 v13.21,64.34 | v40.59,69.75 v39.62,57.91
P0X4  (via drill 0.33)
  Top 0.152: 52.3,72.36 52.29,72.34 | 52.29,72.34 v51.94,71.53 | 74.88,42.95 74.87,42.95 | 74.87,42.95 v73.97,42.82 | 60.68,8.69 60.66,8.71 | 60.66,8.71 v60.12,9.4 | 23.9,3.83 23.91,3.86 | 23.91,3.86 v24.26,4.67 | 1.32,33.25 1.33,33.25 | 1.33,33.25 v2.23,33.38 | 15.52,67.51 15.54,67.49 | 15.54,67.49 v16.08,66.8 | D034.A 23.7,3.89 23.85,3.89 23.91,3.86 | 1.33,33.25 1.32,33.33 1.32,33.45 D044.A | D024.A 60.5,8.56 60.6,8.66 60.66,8.71 | D054.A 15.7,67.64 15.6,67.54 15.54,67.49 | D014.A 74.88,42.75 74.88,42.88 74.87,42.95 | D004.A 52.5,72.31 52.35,72.31 52.29,72.34 | v37.59,57.4 39.34,55.66 U001.10 | 36.5,68.53 37.31,68.58 v37.34,68.58 38.89,68.58 39.7,68.53 40.49,68.48 41.27,68.4 42.09,68.33 43.66,68.07 44.42,67.92 45.21,67.74 46,67.54 46.76,67.33 48.28,66.83 v49.76,66.27 51.23,65.61 52.65,64.9 54.03,64.08 54.71,63.65 55.37,63.22 56.01,62.76 56.67,62.28 57.28,61.8 57.89,61.27 58.5,60.76 59.08,60.2 59.66,59.66 60.2,59.08 60.76,58.5 61.27,57.89 61.8,57.28 62.28,56.67 62.76,56.01 63.22,55.37 63.65,54.71 64.08,54.03 64.9,52.65 65.61,51.23 66.27,49.76 66.83,48.28 67.33,46.76 67.54,46 67.74,45.21 67.92,44.42 68.07,43.66 v68.33,42.09 68.4,41.27 68.48,40.49 68.53,39.7 68.58,38.89 68.58,37.31 68.53,36.5 68.48,35.71 68.4,34.92 68.33,34.11 68.07,32.54 67.92,31.77 67.74,30.99 67.54,30.2 67.33,29.44 66.83,27.91 66.27,26.44 65.61,24.97 64.9,23.55 64.08,22.17 63.65,21.49 63.22,20.83 62.76,20.19 62.28,19.53 61.8,18.92 61.27,18.31 60.76,17.7 60.2,17.12 59.66,16.54 59.08,16 58.5,15.44 57.89,14.94 57.28,14.4 v56.67,13.92 56.01,13.44 55.37,12.98 54.71,12.55 54.03,12.12 52.65,11.3 51.23,10.59 49.76,9.93 48.28,9.37 46.76,8.87 46,8.66 45.21,8.46 44.42,8.28 43.66,8.13 42.09,7.87 41.27,7.8 40.49,7.72 39.7,7.67 38.89,7.62 37.31,7.62 36.5,7.67 35.71,7.72 34.92,7.8 34.11,7.87 32.54,8.13 31.77,8.28 30.99,8.46 30.2,8.66 29.44,8.87 27.91,9.37 v26.44,9.93 24.97,10.59 23.55,11.3 22.17,12.12 21.49,12.55 20.83,12.98 20.19,13.44 19.53,13.92 18.92,14.4 18.31,14.94 17.7,15.44 17.12,16 16.54,16.54 16,17.12 15.44,17.7 14.94,18.31 14.4,18.92 13.92,19.53 13.44,20.19 12.98,20.83 12.55,21.49 12.12,22.17 11.3,23.55 10.59,24.97 9.93,26.44 9.37,27.91 8.87,29.44 8.66,30.2 8.46,30.99 8.28,31.77 8.13,32.54 v7.87,34.11 7.8,34.92 7.72,35.71 7.67,36.5 7.62,37.31 7.62,38.89 7.67,39.7 7.72,40.49 7.8,41.27 7.87,42.09 8.13,43.66 8.28,44.42 8.46,45.21 8.66,46 8.87,46.76 9.37,48.28 9.93,49.76 10.59,51.23 11.3,52.65 12.12,54.03 12.55,54.71 12.98,55.37 13.44,56.01 13.92,56.67 14.4,57.28 14.94,57.89 15.44,58.5 16,59.08 16.54,59.66 17.12,60.2 17.7,60.76 18.31,61.27 18.92,61.8 v19.53,62.28 20.19,62.76 20.83,63.22 21.49,63.65 22.17,64.08 23.55,64.9 24.97,65.61 26.44,66.27 27.91,66.83 29.44,67.33 30.2,67.54 30.99,67.74 31.77,67.92 32.54,68.07 34.11,68.33 34.92,68.4 35.71,68.48 36.5,68.53
  Bottom 0.152: v49.76,66.27 v51.94,71.53 | v68.33,42.09 v73.97,42.82 | v56.67,13.92 v60.12,9.4 | v26.44,9.93 v24.26,4.67 | v7.87,34.11 v2.23,33.38 | v19.53,62.28 v16.08,66.8 | v37.34,68.58 v37.59,57.4
P0X5  (via drill 0.33)  (1 unrouted)
  Top 0.152: v55.35,69.88 55.8,70.69 55.88,70.69 D005.A | 75.16,39.06 | 75.16,39.06 v74.27,39.04 | 57.48,6.48 57.46,6.51 | 57.46,6.51 v57,7.26 | v20.85,6.33 20.4,5.51 20.32,5.51 D035.A | 1.04,37.13 | 1.04,37.13 v1.93,37.16 | 18.72,69.72 18.74,69.69 | 18.74,69.69 v19.2,68.94 | D045.A 1.02,37.24 1.04,37.21 1.04,37.13 | D025.A 57.3,6.38 57.4,6.48 57.46,6.51 | 18.9,69.83 18.8,69.72 18.74,69.69 | 18.9,69.83 D055.A | D055.A | D015.A 75.18,38.86 75.16,38.89 75.16,38.99 75.16,39.06 | v55.63,45.34 52.45,48.51 49.53,48.51 46.76,51.29 U001.1 | D055.A 18.92,69.83 18.9,69.83 | 37.34,67.31 38.86,67.31 41.15,67.16 42.67,66.95 43.43,66.83 44.17,66.67 44.91,66.5 45.67,66.32 46.41,66.12 47.12,65.89 47.85,65.63 48.56,65.38 49.28,65.08 49.99,64.8 51.36,64.14 v52.05,63.78 53.37,63.02 54,62.59 54.63,62.18 55.27,61.72 56.49,60.81 57.07,60.3 57.66,59.82 58.22,59.28 59.28,58.22 59.82,57.66 60.3,57.07 60.81,56.49 61.72,55.27 62.18,54.63 62.59,54 63.02,53.37 63.78,52.05 64.14,51.36 64.8,49.99 v65.08,49.28 65.38,48.56 65.63,47.85 65.89,47.12 66.12,46.41 66.32,45.67 66.5,44.91 66.67,44.17 66.83,43.43 66.95,42.67 67.16,41.15 v67.31,38.86 67.31,37.34 67.16,35.05 66.95,33.53 66.83,32.77 66.67,32.03 66.5,31.29 66.32,30.53 66.12,29.79 65.89,29.08 65.63,28.35 65.38,27.64 65.08,26.92 64.8,26.21 64.14,24.84 63.78,24.16 63.02,22.84 62.59,22.2 62.18,21.57 61.72,20.93 60.81,19.71 60.3,19.13 59.82,18.54 59.28,17.98 58.22,16.92 57.66,16.38 57.07,15.9 56.49,15.39 55.27,14.48 54.63,14.02 54,13.61 v53.37,13.18 52.05,12.42 51.36,12.06 49.99,11.4 49.28,11.12 48.56,10.82 47.85,10.57 47.12,10.31 46.41,10.08 45.67,9.88 44.91,9.7 44.17,9.53 43.43,9.37 42.67,9.25 41.15,9.04 38.86,8.89 37.34,8.89 35.05,9.04 33.53,9.25 32.77,9.37 32.03,9.53 31.29,9.7 30.53,9.88 29.79,10.08 29.08,10.31 28.35,10.57 27.64,10.82 26.92,11.12 26.21,11.4 24.84,12.06 v24.16,12.42 22.84,13.18 22.2,13.61 21.57,14.02 20.93,14.48 19.71,15.39 19.13,15.9 18.54,16.38 17.98,16.92 16.92,17.98 16.38,18.54 15.9,19.13 15.39,19.71 14.48,20.93 14.02,21.57 13.61,22.2 13.18,22.84 12.42,24.16 12.06,24.84 11.4,26.21 11.12,26.92 10.82,27.64 10.57,28.35 10.31,29.08 10.08,29.79 9.88,30.53 9.7,31.29 9.53,32.03 9.37,32.77 9.25,33.53 9.04,35.05 v8.89,37.34 8.89,38.86 9.04,41.15 9.25,42.67 9.37,43.43 9.53,44.17 9.7,44.91 9.88,45.67 10.08,46.41 10.31,47.12 10.57,47.85 10.82,48.56 11.12,49.28 11.4,49.99 12.06,51.36 12.42,52.05 13.18,53.37 13.61,54 14.02,54.63 14.48,55.27 15.39,56.49 15.9,57.07 16.38,57.66 16.92,58.22 17.98,59.28 18.54,59.82 19.13,60.3 19.71,60.81 20.93,61.72 21.57,62.18 22.2,62.59 v22.84,63.02 24.16,63.78 24.84,64.14 26.21,64.8 26.92,65.08 27.64,65.38 28.35,65.63 29.08,65.89 29.79,66.12 30.53,66.32 31.29,66.5 32.03,66.67 32.77,66.83 33.53,66.95 35.05,67.16 37.34,67.31
  Bottom 0.152: v52.05,63.78 v55.35,69.88 | v67.31,38.86 v74.27,39.04 | v53.37,13.18 v57,7.26 | v24.16,12.42 v20.85,6.33 | v8.89,37.34 v1.93,37.16 | v22.84,63.02 v19.2,68.94 | v65.08,49.28 v55.63,45.34
P0X6  (via drill 0.33)
  Top 0.152: v58.6,67.92 59.11,68.66 59.18,68.66 59.28,68.56 D006.A | v74.17,35.26 75.06,35.18 75.06,34.98 D016.A | 54.08,4.62 54.04,4.7 | 54.04,4.7 v53.67,5.46 | v17.6,8.28 17.09,7.54 17.02,7.54 16.92,7.64 D036.A | v2.03,40.95 1.14,41.02 1.14,41.22 D046.A | 22.12,71.58 22.16,71.5 | 22.16,71.5 v22.53,70.74 | D026.A 53.87,4.55 53.98,4.65 53.98,4.67 54.04,4.7 | D056.A 22.33,71.65 22.23,71.55 22.23,71.53 22.16,71.5 | U001.5 43.56,53.34 v43.56,56.13 | 36.63,65.99 37.36,66.04 38.84,66.04 39.57,65.99 40.28,65.96 41.76,65.81 42.47,65.68 43.18,65.58 43.92,65.43 v44.63,65.28 45.34,65.1 46.02,64.9 46.74,64.67 47.42,64.44 48.11,64.19 48.79,63.91 49.45,63.63 50.14,63.32 50.77,62.99 51.44,62.66 52.07,62.31 52.7,61.92 53.31,61.54 v53.92,61.14 54.53,60.71 55.12,60.27 55.68,59.82 56.79,58.85 57.33,58.37 57.86,57.86 58.37,57.33 58.85,56.79 59.82,55.68 60.27,55.12 60.71,54.53 61.14,53.92 61.54,53.31 61.92,52.7 62.31,52.07 62.66,51.44 62.99,50.77 63.32,50.14 63.63,49.45 63.91,48.79 64.19,48.11 64.44,47.42 64.67,46.74 64.9,46.02 65.1,45.34 65.28,44.63 65.43,43.92 65.58,43.18 65.68,42.47 65.81,41.76 65.96,40.28 65.99,39.57 66.04,38.84 66.04,37.36 65.99,36.63 v65.96,35.92 65.81,34.44 65.68,33.73 65.58,33.02 65.43,32.28 65.28,31.57 65.1,30.86 64.9,30.18 64.67,29.46 64.44,28.78 64.19,28.09 63.91,27.41 63.63,26.75 63.32,26.06 62.99,25.43 62.66,24.77 62.31,24.13 61.92,23.5 61.54,22.89 61.14,22.28 60.71,21.67 60.27,21.08 59.82,20.52 58.85,19.41 58.37,18.87 57.86,18.34 57.33,17.83 56.79,17.35 55.68,16.38 55.12,15.93 54.53,15.49 53.92,15.06 53.31,14.66 52.7,14.28 52.07,13.89 51.44,13.54 50.77,13.21 v50.14,12.88 49.45,12.57 48.79,12.29 48.11,12.01 47.42,11.76 46.74,11.53 46.02,11.3 45.34,11.1 44.63,10.92 43.92,10.77 43.18,10.62 42.47,10.52 41.76,10.39 40.28,10.24 39.57,10.21 38.84,10.16 37.36,10.16 36.63,10.21 35.92,10.24 34.44,10.39 33.73,10.52 33.02,10.62 32.28,10.77 31.57,10.92 30.86,11.1 30.18,11.3 29.46,11.53 28.78,11.76 28.09,12.01 27.41,12.29 26.75,12.57 26.06,12.88 25.43,13.21 24.77,13.54 24.13,13.89 23.5,14.28 22.89,14.66 v22.28,15.06 21.67,15.49 21.08,15.93 20.52,16.38 19.41,17.35 18.87,17.83 18.34,18.34 17.83,18.87 17.35,19.41 16.38,20.52 15.93,21.08 15.49,21.67 15.06,22.28 14.66,22.89 14.28,23.5 13.89,24.13 13.54,24.77 13.21,25.43 12.88,26.06 12.57,26.75 12.29,27.41 12.01,28.09 11.76,28.78 11.53,29.46 11.3,30.18 11.1,30.86 10.92,31.57 10.77,32.28 10.62,33.02 10.52,33.73 10.39,34.44 10.24,35.92 10.21,36.63 10.16,37.36 10.16,38.84 10.21,39.57 v10.24,40.28 10.39,41.76 10.52,42.47 10.62,43.18 10.77,43.92 10.92,44.63 11.1,45.34 11.3,46.02 11.53,46.74 11.76,47.42 12.01,48.11 12.29,48.79 12.57,49.45 12.88,50.14 13.21,50.77 13.54,51.44 13.89,52.07 14.28,52.7 14.66,53.31 15.06,53.92 15.49,54.53 15.93,55.12 16.38,55.68 17.35,56.79 17.83,57.33 18.34,57.86 18.87,58.37 19.41,58.85 20.52,59.82 21.08,60.27 21.67,60.71 22.28,61.14 22.89,61.54 23.5,61.92 24.13,62.31 24.77,62.66 25.43,62.99 v26.06,63.32 26.75,63.63 27.41,63.91 28.09,64.19 28.78,64.44 29.46,64.67 30.18,64.9 30.86,65.1 31.57,65.28 32.28,65.43 33.02,65.58 33.73,65.68 34.44,65.81 35.92,65.96 36.63,65.99
  Bottom 0.152: v53.92,61.14 v58.6,67.92 | v74.17,35.26 v65.96,35.92 65.86,36.02 | v50.14,12.88 v53.67,5.46 | v22.28,15.06 v17.6,8.28 | v10.24,40.28 v2.03,40.95 | v26.06,63.32 v22.53,70.74 | v44.63,65.28 43.05,58.6 43.05,56.64 v43.56,56.13
P0X7  (via drill 0.33)
  Top 0.152: v61.59,65.61 62.18,66.29 62.26,66.27 D007.A | v73.66,31.5 74.57,31.34 74.57,31.14 74.55,31.11 D017.A | 50.47,3.15 50.46,3.17 | 50.46,3.17 v50.16,4.01 | v14.61,10.59 14.02,9.91 13.95,9.93 D037.A | v2.54,44.7 1.63,44.86 1.63,45.06 1.65,45.09 D047.A | 25.73,73.05 25.75,73 | 25.75,73 v26.04,72.19 | 50.46,3.17 50.39,3.15 50.29,3.05 D027.A | D057.A 25.91,73.13 25.81,73.03 25.75,73 | U001.6 arc-90 41.95,53.85 42.67,53.85 42.67,56.39 40.89,58.17 v40.89,59.05 | 36.7,64.75 37.41,64.77 38.79,64.77 39.5,64.75 40.18,64.69 40.89,64.62 v41.58,64.54 42.27,64.44 43.64,64.19 44.32,64.03 45.01,63.86 45.67,63.68 46.33,63.48 46.99,63.25 48.31,62.74 49.58,62.18 50.22,61.87 50.83,61.54 52.05,60.83 52.63,60.48 53.21,60.07 54.33,59.26 54.89,58.83 v55.42,58.37 55.96,57.91 56.46,57.45 56.95,56.95 57.45,56.46 57.91,55.96 58.83,54.89 59.26,54.33 60.07,53.21 60.48,52.63 60.83,52.05 61.54,50.83 61.87,50.22 62.18,49.58 62.74,48.31 63.25,46.99 63.48,46.33 63.68,45.67 63.86,45.01 64.03,44.32 64.19,43.64 64.44,42.27 64.54,41.58 64.62,40.89 64.69,40.18 64.75,39.5 64.77,38.79 64.77,37.41 64.75,36.7 64.69,36.02 64.62,35.31 64.54,34.62 64.44,33.93 v64.31,33.25 64.19,32.56 64.03,31.88 63.86,31.19 63.68,30.53 63.48,29.87 63.25,29.21 62.74,27.89 62.18,26.62 61.87,25.98 61.54,25.38 60.83,24.16 60.48,23.57 60.07,22.99 59.26,21.87 58.83,21.31 57.91,20.24 57.45,19.74 56.95,19.25 56.46,18.75 55.96,18.29 54.89,17.37 54.33,16.94 53.21,16.13 52.63,15.72 52.05,15.37 50.83,14.66 50.22,14.33 49.58,14.02 48.31,13.46 v46.99,12.95 46.33,12.72 45.67,12.52 45.01,12.34 44.32,12.17 43.64,12.01 42.27,11.76 41.58,11.66 40.89,11.58 40.18,11.51 39.5,11.46 38.79,11.43 37.41,11.43 36.7,11.46 36.02,11.51 35.31,11.58 34.62,11.66 33.93,11.76 32.56,12.01 31.88,12.17 31.19,12.34 30.53,12.52 29.87,12.72 29.21,12.95 27.89,13.46 26.62,14.02 25.98,14.33 25.38,14.66 24.16,15.37 23.57,15.72 22.99,16.13 21.87,16.94 21.31,17.37 v20.78,17.83 20.24,18.29 19.74,18.75 19.25,19.25 18.75,19.74 18.29,20.24 17.37,21.31 16.94,21.87 16.13,22.99 15.72,23.57 15.37,24.16 14.66,25.38 14.33,25.98 14.02,26.62 13.46,27.89 12.95,29.21 12.72,29.87 12.52,30.53 12.34,31.19 12.17,31.88 12.01,32.56 11.76,33.93 11.66,34.62 11.58,35.31 11.51,36.02 11.46,36.7 11.43,37.41 11.43,38.79 11.46,39.5 11.51,40.18 11.58,40.89 11.66,41.58 11.76,42.27 v11.89,42.95 12.01,43.64 12.17,44.32 12.34,45.01 12.52,45.67 12.72,46.33 12.95,46.99 13.46,48.31 14.02,49.58 14.33,50.22 14.66,50.83 15.37,52.05 15.72,52.63 16.13,53.21 16.94,54.33 17.37,54.89 18.29,55.96 18.75,56.46 19.25,56.95 19.74,57.45 20.24,57.91 21.31,58.83 21.87,59.26 22.99,60.07 23.57,60.48 24.16,60.83 25.38,61.54 25.98,61.87 26.62,62.18 27.89,62.74 v29.21,63.25 29.87,63.48 30.53,63.68 31.19,63.86 31.88,64.03 32.56,64.19 33.93,64.44 34.62,64.54 35.31,64.62 36.02,64.69 36.7,64.75
  Bottom 0.152: v55.42,58.37 v61.59,65.61 | v64.31,33.25 v73.66,31.5 | v46.99,12.95 v50.16,4.01 | v20.78,17.83 v14.61,10.59 | v11.89,42.95 v2.54,44.7 | v29.21,63.25 v26.04,72.19 | v41.58,64.54 v40.89,59.05
P0X8  (via drill 0.33)
  Top 0.152: v64.34,62.99 65,63.63 D008.A | v72.77,27.84 73.66,27.56 73.66,27.41 73.64,27.38 D018.A | v46.53,2.92 46.76,2.03 46.71,1.98 D028.A | v11.86,13.21 11.2,12.57 D038.A | v3.43,48.36 2.54,48.64 2.54,48.72 2.56,48.74 2.56,48.82 D048.A | v29.67,73.28 29.44,74.17 29.49,74.22 D058.A | v38.68,59.44 38.68,57.58 40.39,55.88 U001.9 | 36.78,63.48 37.44,63.5 v38.76,63.5 39.42,63.48 40.08,63.42 40.77,63.37 41.43,63.27 41.72,63.24 42.06,63.2 43.38,62.94 44.02,62.79 44.68,62.64 45.31,62.46 46.58,62.05 47.19,61.82 47.83,61.57 48.44,61.32 49.05,61.04 50.22,60.43 50.8,60.1 51.36,59.77 51.94,59.41 52.48,59.03 53.03,58.65 53.57,58.24 54.08,57.84 55.09,56.97 56.06,56.06 v56.52,55.58 56.97,55.09 57.84,54.08 58.24,53.57 58.65,53.03 59.03,52.48 59.41,51.94 59.77,51.36 60.1,50.8 60.43,50.22 61.04,49.05 61.32,48.44 61.57,47.83 61.82,47.19 62.05,46.58 62.46,45.31 62.64,44.68 62.79,44.02 62.94,43.38 63.2,42.06 63.27,41.43 63.37,40.77 63.42,40.08 63.48,39.42 63.5,38.76 63.5,37.44 63.48,36.78 63.42,36.12 63.37,35.43 63.27,34.77 63.2,34.14 62.94,32.82 62.79,32.18 62.64,31.52 v62.46,30.89 62.05,29.62 61.82,29.01 61.57,28.37 61.32,27.76 61.04,27.15 60.43,25.98 60.1,25.4 59.77,24.84 59.41,24.26 59.03,23.72 58.65,23.16 58.24,22.63 57.84,22.12 56.97,21.11 56.06,20.14 55.09,19.23 54.08,18.36 53.57,17.96 53.03,17.55 52.48,17.17 51.94,16.79 51.36,16.43 50.8,16.1 50.22,15.77 49.05,15.16 48.44,14.88 47.83,14.63 47.19,14.38 46.58,14.15 45.31,13.74 44.68,13.56 v44.02,13.41 43.38,13.26 42.06,13.01 41.43,12.93 40.77,12.83 40.08,12.78 39.42,12.72 38.76,12.7 37.44,12.7 36.78,12.72 36.12,12.78 35.43,12.83 34.77,12.93 34.14,13.01 32.82,13.26 32.18,13.41 31.52,13.56 30.89,13.74 29.62,14.15 29.01,14.38 28.37,14.63 27.76,14.88 27.15,15.16 25.98,15.77 25.4,16.1 24.84,16.43 24.26,16.79 23.72,17.17 23.16,17.55 22.63,17.96 22.12,18.36 21.11,19.23 20.14,20.14 v19.68,20.62 19.23,21.11 18.36,22.12 17.96,22.63 17.55,23.16 17.17,23.72 16.79,24.26 16.43,24.84 16.1,25.4 15.77,25.98 15.16,27.15 14.88,27.76 14.63,28.37 14.38,29.01 14.15,29.62 13.74,30.89 13.56,31.52 13.41,32.18 13.26,32.82 13.01,34.14 12.93,34.77 12.83,35.43 12.78,36.12 12.72,36.78 12.7,37.44 12.7,38.76 12.72,39.42 12.78,40.08 12.83,40.77 12.93,41.43 13.01,42.06 13.26,43.38 13.41,44.02 13.56,44.68 v13.74,45.31 14.15,46.58 14.38,47.19 14.63,47.83 14.88,48.44 15.16,49.05 15.77,50.22 16.1,50.8 16.43,51.36 16.79,51.94 17.17,52.48 17.55,53.03 17.96,53.57 18.36,54.08 19.23,55.09 20.14,56.06 21.11,56.97 22.12,57.84 22.63,58.24 23.16,58.65 23.72,59.03 24.26,59.41 24.84,59.77 25.4,60.1 25.98,60.43 27.15,61.04 27.76,61.32 28.37,61.57 29.01,61.82 29.62,62.05 30.89,62.46 31.52,62.64 v32.18,62.79 32.82,62.94 34.14,63.2 34.77,63.27 35.43,63.37 36.12,63.42 36.78,63.48
  Bottom 0.152: v56.52,55.58 v64.34,62.99 | v62.46,30.89 v72.77,27.84 | v44.02,13.41 v46.53,2.92 | v19.68,20.62 v11.86,13.21 | v13.74,45.31 v3.43,48.36 | v32.18,62.79 v29.67,73.28 | v38.68,59.44 v38.76,63.5
P0X9  (via drill 0.33)
  Top 0.152: 67.51,60.68 67.49,60.66 | 67.49,60.66 v66.8,60.12 | v71.53,24.26 72.36,23.9 72.36,23.75 72.31,23.7 D019.A | 42.95,1.32 42.95,1.33 | 42.95,1.33 v42.82,2.23 | 8.69,15.52 8.71,15.54 | 8.71,15.54 v9.4,16.08 | v4.67,51.94 3.83,52.3 3.83,52.45 3.89,52.5 D049.A | 33.25,74.88 33.25,74.87 | 33.25,74.87 v33.38,73.97 | D039.A 8.56,15.7 8.66,15.6 8.71,15.54 | 42.95,1.33 42.88,1.32 42.75,1.32 D029.A | D059.A 33.45,74.88 33.33,74.88 33.25,74.87 | D009.A 67.64,60.5 67.54,60.6 67.49,60.66 | U001.11 38.61,53.84 37.59,54.85 37.59,56.39 36.07,57.91 v35.56,57.91 | 36.83,62.2 37.47,62.23 38.73,62.23 39.37,62.2 40.01,62.15 40.62,62.1 41.25,62.03 41.88,61.92 42.49,61.82 43.13,61.7 43.74,61.57 44.35,61.42 45.57,61.06 46.15,60.86 46.74,60.63 47.35,60.4 47.9,60.15 48.49,59.87 49.61,59.31 50.16,59 51.23,58.34 51.77,57.99 52.27,57.63 52.76,57.27 52.78,57.25 53.29,56.84 54.25,56.03 55.17,55.17 56.03,54.25 56.84,53.29 v57.25,52.78 57.63,52.27 57.99,51.77 58.34,51.23 59,50.16 59.31,49.61 59.87,48.49 60.15,47.9 60.4,47.35 60.63,46.74 60.86,46.15 61.06,45.57 61.42,44.35 61.57,43.74 61.7,43.13 61.82,42.49 61.92,41.88 62.03,41.25 62.1,40.62 62.15,40.01 62.2,39.37 62.23,38.73 62.23,37.47 62.2,36.83 62.15,36.2 62.1,35.59 62.03,34.95 61.92,34.31 61.82,33.71 61.7,33.07 61.57,32.46 61.42,31.85 61.06,30.63 60.86,30.05 60.63,29.46 v60.4,28.85 60.15,28.3 59.87,27.71 59.31,26.59 59,26.04 58.34,24.97 57.99,24.43 57.63,23.93 57.25,23.42 56.84,22.91 56.03,21.95 55.17,21.03 54.25,20.17 53.29,19.36 52.78,18.95 52.27,18.57 51.77,18.21 51.23,17.86 50.16,17.2 49.61,16.89 48.49,16.33 47.9,16.05 47.35,15.8 46.74,15.57 46.15,15.34 45.57,15.14 44.35,14.78 43.74,14.63 43.13,14.5 42.49,14.38 41.88,14.28 v41.25,14.17 40.62,14.1 40.01,14.05 39.37,13.99 38.73,13.97 37.47,13.97 36.83,13.99 36.2,14.05 35.59,14.1 34.95,14.17 34.31,14.28 33.71,14.38 33.07,14.5 32.46,14.63 31.85,14.78 30.63,15.14 30.05,15.34 29.46,15.57 28.85,15.8 28.3,16.05 27.71,16.33 26.59,16.89 26.04,17.2 24.97,17.86 24.43,18.21 23.93,18.57 23.42,18.95 22.91,19.36 21.95,20.17 21.03,21.03 20.17,21.95 19.36,22.91 v18.95,23.42 18.57,23.93 18.21,24.43 17.86,24.97 17.2,26.04 16.89,26.59 16.33,27.71 16.05,28.3 15.8,28.85 15.57,29.46 15.34,30.05 15.14,30.63 14.78,31.85 14.63,32.46 14.5,33.07 14.38,33.71 14.28,34.31 14.17,34.95 14.1,35.59 14.05,36.2 13.99,36.83 13.97,37.47 13.97,38.73 13.99,39.37 14.05,40.01 14.1,40.62 14.17,41.25 14.28,41.88 14.38,42.49 14.5,43.13 14.63,43.74 14.78,44.35 15.14,45.57 15.34,46.15 15.57,46.74 v15.8,47.35 16.05,47.9 16.33,48.49 16.89,49.61 17.2,50.16 17.86,51.23 18.21,51.77 18.57,52.27 18.95,52.78 19.36,53.29 20.17,54.25 21.03,55.17 21.95,56.03 22.91,56.84 23.42,57.25 23.93,57.63 24.43,57.99 24.97,58.34 26.04,59 26.59,59.31 27.71,59.87 28.3,60.15 28.85,60.4 29.46,60.63 30.05,60.86 30.63,61.06 31.85,61.42 32.46,61.57 33.07,61.7 33.71,61.82 34.31,61.92 v34.95,62.03 35.59,62.1 36.2,62.15 36.83,62.2
  Bottom 0.152: v57.25,52.78 v66.8,60.12 | v60.4,28.85 v71.53,24.26 | v41.25,14.17 v42.82,2.23 | v18.95,23.42 v9.4,16.08 | v15.8,47.35 v4.67,51.94 | v33.38,73.97 v34.95,62.03 arc2 v35.56,57.91
P01X  (1 unrouted)
P1X0  (via drill 0.33)
  Top 0.152: U101.3 28.21,23.86 25.4,26.67 v22.1,26.67 | 37.19,73.03 v39.01,73.03 40.84,72.92 41.76,72.82 42.65,72.72 43.56,72.59 44.48,72.44 45.36,72.26 46.25,72.06 47.14,71.83 48.03,71.58 48.9,71.32 50.62,70.71 52.3,70 53.14,69.62 53.95,69.22 55.58,68.35 56.34,67.87 57.12,67.39 57.89,66.88 59.36,65.81 60.07,65.25 60.78,64.67 61.47,64.06 62.79,62.79 64.06,61.47 64.67,60.78 65.25,60.07 65.81,59.36 66.88,57.89 67.39,57.12 67.87,56.34 68.35,55.58 v68.78,54.76 69.22,53.95 69.62,53.14 70,52.3 70.71,50.62 71.32,48.9 71.58,48.03 71.83,47.14 72.06,46.25 72.26,45.36 72.44,44.48 72.59,43.56 72.72,42.65 72.82,41.76 72.92,40.84 73.03,39.01 73.03,37.19 72.92,35.36 72.82,34.44 72.72,33.55 72.59,32.64 72.44,31.73 72.26,30.84 72.06,29.95 71.83,29.06 71.58,28.17 71.32,27.3 70.71,25.58 70,23.9 69.62,23.06 69.22,22.25 68.78,21.44 68.35,20.65 v67.87,19.86 67.39,19.07 66.88,18.31 65.81,16.84 65.25,16.13 64.67,15.42 64.06,14.73 62.79,13.41 61.47,12.14 60.78,11.53 60.07,10.95 59.36,10.39 57.89,9.32 57.12,8.81 56.34,8.33 55.58,7.85 53.95,6.99 53.14,6.58 52.3,6.2 50.62,5.49 48.9,4.88 48.03,4.62 47.14,4.37 46.25,4.14 45.36,3.94 44.48,3.76 43.56,3.61 42.65,3.48 41.76,3.38 40.84,3.28 39.01,3.17 v37.19,3.17 35.36,3.28 34.44,3.38 33.55,3.48 32.64,3.61 31.73,3.76 30.84,3.94 29.95,4.14 29.06,4.37 28.17,4.62 27.3,4.88 25.58,5.49 23.9,6.2 23.06,6.58 22.25,6.99 21.44,7.42 20.65,7.85 19.07,8.81 18.31,9.32 16.84,10.39 16.13,10.95 15.42,11.53 14.73,12.14 13.41,13.41 12.14,14.73 11.53,15.42 10.95,16.13 10.39,16.84 9.32,18.31 8.81,19.07 7.85,20.65 v7.42,21.44 6.99,22.25 6.58,23.06 6.2,23.9 5.49,25.58 4.88,27.3 4.62,28.17 4.37,29.06 4.14,29.95 3.94,30.84 3.76,31.73 3.61,32.64 3.48,33.55 3.38,34.44 3.28,35.36 3.17,37.19 3.17,39.01 3.28,40.84 3.38,41.76 3.48,42.65 3.61,43.56 3.76,44.48 3.94,45.36 4.14,46.25 4.37,47.14 4.62,48.03 4.88,48.9 5.49,50.62 6.2,52.3 6.58,53.14 6.99,53.95 7.85,55.58 v8.33,56.34 8.81,57.12 9.32,57.89 10.39,59.36 10.95,60.07 11.53,60.78 12.14,61.47 13.41,62.79 14.73,64.06 15.42,64.67 16.13,65.25 16.84,65.81 18.31,66.88 19.07,67.39 20.65,68.35 21.44,68.78 22.25,69.22 23.06,69.62 23.9,70 25.58,70.71 27.3,71.32 28.17,71.58 29.06,71.83 29.95,72.06 30.84,72.26 31.73,72.44 32.64,72.59 33.55,72.72 34.44,72.82 35.36,72.92 37.19,73.03
  Bottom 0.152: v39.01,73.03 39.06,75.16 | 39.06,75.16 | v68.78,54.76 70.69,55.8 70.69,55.88 D110.A | v67.87,19.86 69.69,18.74 | 69.69,18.74 69.72,18.72 | v37.19,3.17 37.13,1.04 | 37.13,1.04 | v8.33,56.34 6.51,57.46 | 6.51,57.46 6.48,57.48 | D140.A | D130.A 37.24,1.02 37.21,1.04 37.13,1.04 | D150.A 6.38,57.3 6.48,57.4 6.51,57.46 | D120.A 69.83,18.9 69.72,18.8 69.69,18.74 | D100.A 38.86,75.18 38.89,75.16 38.99,75.16 39.06,75.16 | D140.A 5.51,20.32 5.51,20.4 v7.42,21.44 19.81,28.19 21.34,26.67 v22.1,26.67
  Bottom 0.406: 6.38,57.3 6.37,57.3 D150.A
P1X1  (via drill 0.33)
  Top 0.152: U101.2 28.21,24.36 25.4,27.18 22.61,27.18 v22.1,27.69 | 36.35,71.7 37.21,71.75 38.99,71.75 39.85,71.7 40.74,71.65 41.63,71.58 v42.49,71.48 43.36,71.35 44.22,71.2 45.09,71.02 46.81,70.61 48.49,70.1 49.33,69.83 50.16,69.52 50.98,69.19 51.79,68.83 52.58,68.48 53.39,68.1 54.15,67.67 54.94,67.23 55.68,66.8 56.44,66.32 57.15,65.84 57.89,65.33 58.6,64.8 59.28,64.26 59.97,63.7 60.63,63.12 61.9,61.9 63.12,60.63 63.7,59.97 64.26,59.28 64.8,58.6 65.33,57.89 65.84,57.15 66.32,56.44 66.8,55.68 67.23,54.94 67.67,54.15 68.1,53.39 68.48,52.58 68.83,51.79 v69.19,50.98 69.52,50.16 69.83,49.33 70.1,48.49 70.61,46.81 71.02,45.09 71.2,44.22 71.35,43.36 71.48,42.49 71.58,41.63 71.65,40.74 71.7,39.85 71.75,38.99 71.75,37.21 71.7,36.35 71.65,35.46 71.58,34.57 71.48,33.71 71.35,32.84 71.2,31.98 71.02,31.11 70.61,29.39 70.1,27.71 69.83,26.87 69.52,26.04 69.19,25.22 68.83,24.41 68.48,23.62 68.1,22.81 66.8,20.52 66.32,19.76 65.84,19.05 65.33,18.31 v64.8,17.6 64.26,16.92 63.7,16.23 63.12,15.57 61.9,14.3 60.63,13.08 59.97,12.5 59.28,11.94 58.6,11.4 57.89,10.87 57.15,10.36 56.44,9.88 55.68,9.4 54.94,8.97 54.15,8.53 53.39,8.1 52.58,7.72 51.79,7.37 50.98,7.01 50.16,6.68 49.33,6.38 48.49,6.1 46.81,5.59 45.09,5.18 44.22,5 43.36,4.85 42.49,4.72 41.63,4.62 40.74,4.55 39.85,4.5 38.99,4.45 37.21,4.45 36.35,4.5 35.46,4.55 34.57,4.62 v33.71,4.72 32.84,4.85 31.98,5 31.11,5.18 29.39,5.59 27.71,6.1 26.87,6.38 26.04,6.68 25.22,7.01 24.41,7.37 23.62,7.72 22.81,8.1 20.52,9.4 19.76,9.88 19.05,10.36 18.31,10.87 17.6,11.4 16.92,11.94 16.23,12.5 15.57,13.08 14.3,14.3 13.08,15.57 12.5,16.23 11.94,16.92 11.4,17.6 10.87,18.31 10.36,19.05 9.88,19.76 9.4,20.52 8.1,22.81 7.72,23.62 7.37,24.41 v7.01,25.22 6.68,26.04 6.38,26.87 6.1,27.71 5.59,29.39 5.18,31.11 5,31.98 4.85,32.84 4.72,33.71 4.62,34.57 4.55,35.46 4.5,36.35 4.45,37.21 4.45,38.99 4.5,39.85 4.55,40.74 4.62,41.63 4.72,42.49 4.85,43.36 5,44.22 5.18,45.09 5.59,46.81 6.1,48.49 6.38,49.33 6.68,50.16 7.01,50.98 7.37,51.79 7.72,52.58 8.1,53.39 8.53,54.15 8.97,54.94 9.4,55.68 9.88,56.44 10.36,57.15 10.87,57.89 v11.4,58.6 11.94,59.28 12.5,59.97 13.08,60.63 14.3,61.9 15.57,63.12 16.23,63.7 16.92,64.26 17.6,64.8 18.31,65.33 19.05,65.84 19.76,66.32 20.52,66.8 22.81,68.1 23.62,68.48 24.41,68.83 25.22,69.19 26.04,69.52 26.87,69.83 27.71,70.1 29.39,70.61 31.11,71.02 31.98,71.2 32.84,71.35 33.71,71.48 34.57,71.58 35.46,71.65 36.35,71.7
  Bottom 0.152: v42.49,71.48 42.95,74.87 | 42.95,74.87 42.95,74.88 | v69.19,50.98 72.32,52.28 | 72.32,52.28 72.36,52.3 | v64.8,17.6 67.49,15.54 | 67.49,15.54 67.51,15.52 | 33.25,1.33 v33.71,4.72 33.76,4.78 | 33.25,1.33 33.25,1.32 | 3.88,23.92 v7.01,25.22 19.68,30.48 22.1,28.07 v22.1,27.69 | 3.88,23.92 3.83,23.9 | v11.4,58.6 8.71,60.66 | 8.71,60.66 8.69,60.68 | D141.A 3.91,23.85 3.88,23.92 | 33.25,1.33 33.33,1.32 33.45,1.32 D131.A | D151.A 8.56,60.5 8.66,60.6 8.71,60.66 | D121.A 67.64,15.7 67.54,15.6 67.49,15.54 | D101.A 42.75,74.88 42.88,74.88 42.95,74.87 | D111.A 72.29,52.35 72.32,52.28
P1X2  (via drill 0.33)